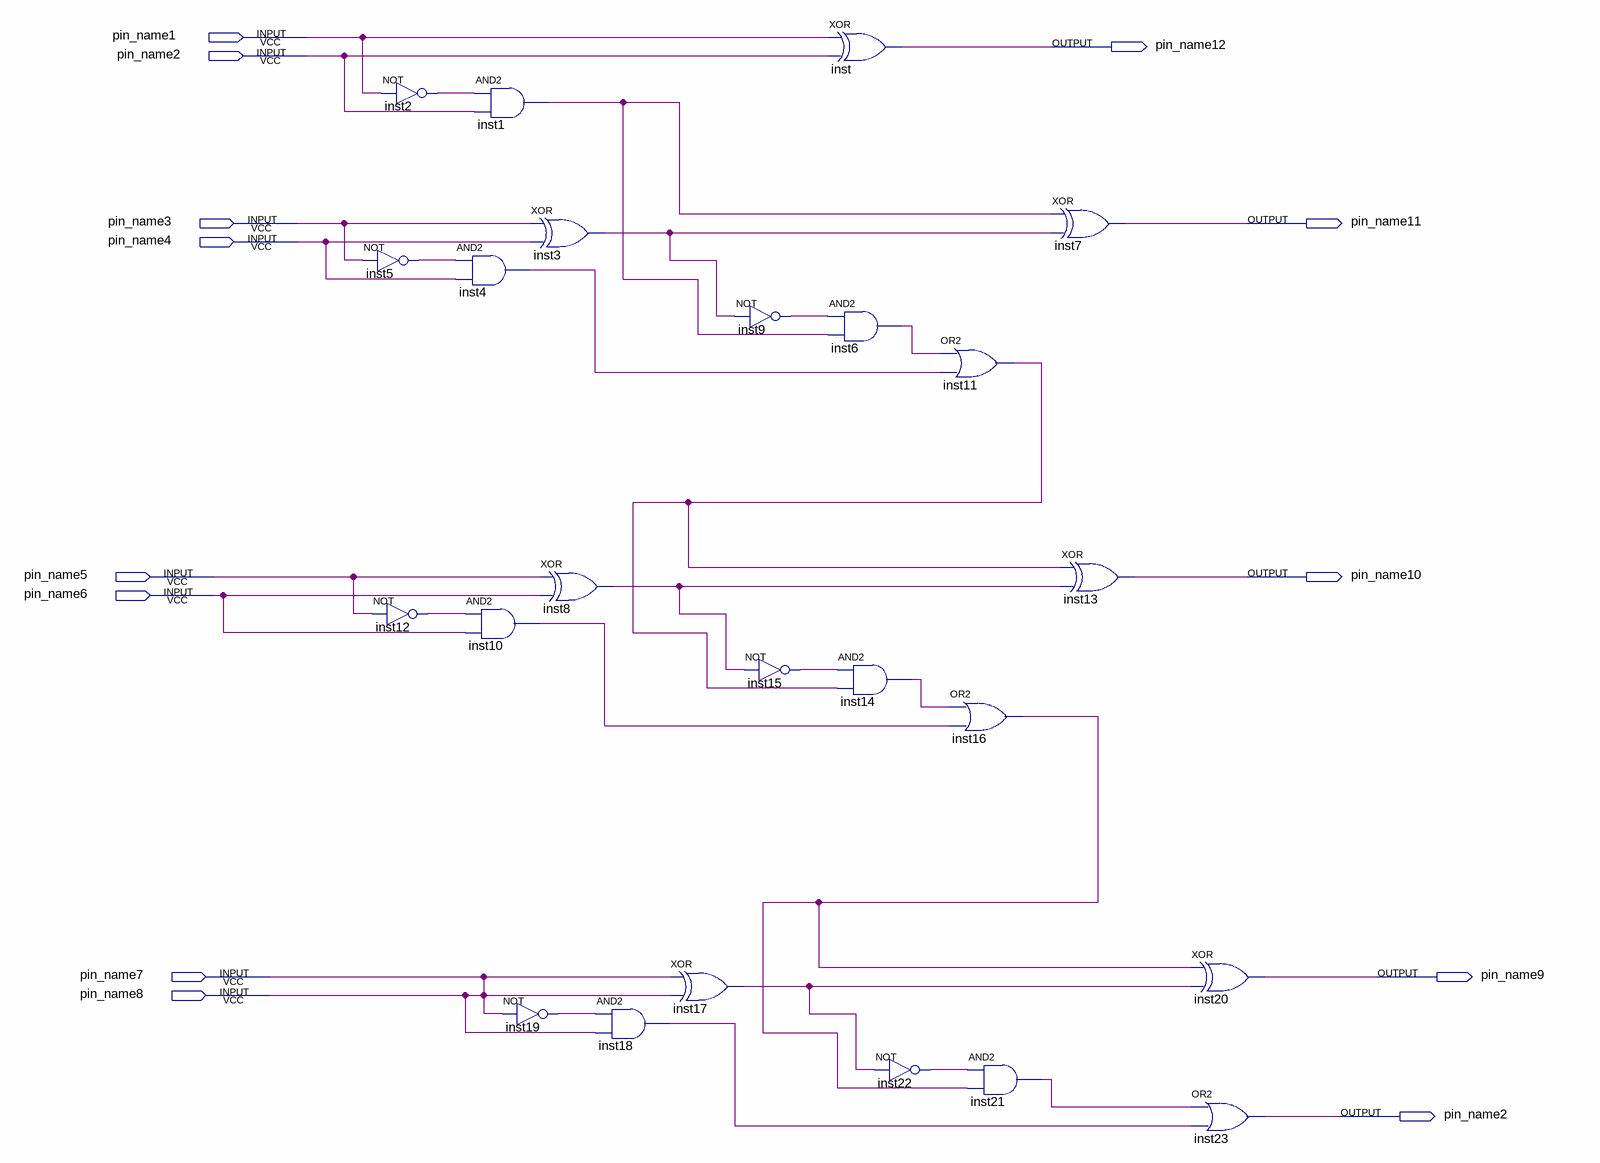
[diagram p0: schematic sheet]
// Quartus schematic Block2.bdf as structural Verilog: 24 symbols, 13 pins
module Block2 (
  input  pin_name1,
  inout  pin_name2,
  input  pin_name3,
  input  pin_name4,
  input  pin_name5,
  input  pin_name6,
  input  pin_name7,
  input  pin_name8,
  output pin_name12,
  output pin_name11,
  output pin_name10,
  output pin_name9
);

  wire inst1_out, inst2_out, inst3_out, inst4_out, inst5_out, inst6_out, inst8_out, inst9_out, inst10_out,
       inst11_out, inst12_out, inst14_out, inst15_out, inst16_out, inst17_out, inst18_out, inst19_out,
       inst21_out, inst22_out;

  not inst5 (inst5_out, pin_name3);
  not inst2 (inst2_out, pin_name1);
  not inst12 (inst12_out, pin_name5);
  and inst1 (inst1_out, inst2_out, pin_name2);
  and inst4 (inst4_out, inst5_out, pin_name4);
  and inst10 (inst10_out, inst12_out, pin_name6);
  not inst19 (inst19_out, pin_name7);
  xor inst3 (inst3_out, pin_name3, pin_name4);
  xor inst8 (inst8_out, pin_name5, pin_name6);
  and inst18 (inst18_out, inst19_out, pin_name7);
  not inst9 (inst9_out, inst3_out);
  xor inst17 (inst17_out, pin_name7, pin_name7);
  not inst15 (inst15_out, inst8_out);
  xor inst (pin_name12, pin_name1, pin_name2);
  and inst6 (inst6_out, inst9_out, inst1_out);
  and inst14 (inst14_out, inst15_out, inst11_out);
  not inst22 (inst22_out, inst17_out);
  or inst11 (inst11_out, inst6_out, inst4_out);
  or inst16 (inst16_out, inst14_out, inst10_out);
  and inst21 (inst21_out, inst22_out, inst16_out);
  xor inst7 (pin_name11, inst1_out, inst3_out);
  xor inst13 (pin_name10, inst11_out, inst8_out);
  xor inst20 (pin_name9, inst16_out, inst17_out);
  or inst23 (pin_name2, inst21_out, inst18_out);

  assign pin_name8 = pin_name7;
endmodule
